# EAGLE design Bot (EAGLE 5.11)
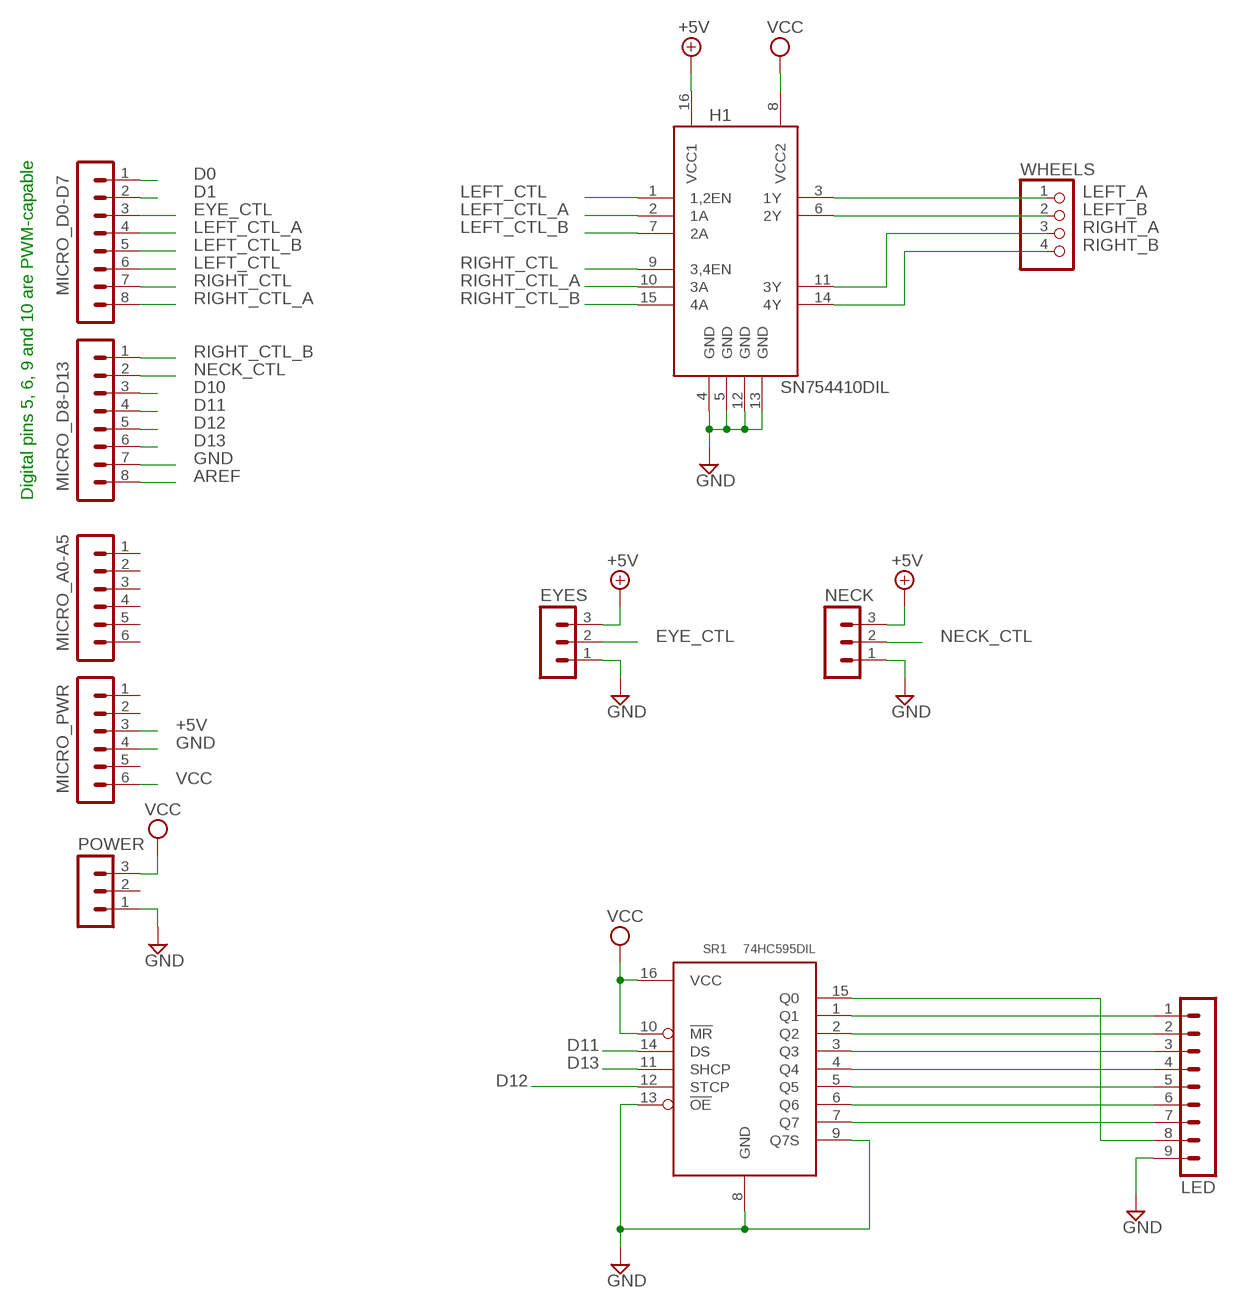
[diagram p0: schematic, sheet 1]

## Parts
EYES  MA03-1  [MA03-1]
H1  SN754410DIL  [DIL16]
LED  MA09-1  [MA09-1]
MICRO_A0-A5  MA06-1  [MA06-1]
MICRO_D0-D7  MA08-1  [MA08-1]
MICRO_D8-D13  MA08-1  [MA08-1]
MICRO_PWR  MA06-1  [MA06-1]
NECK  MA03-1  [MA03-1]
POWER  MA03-1  [MA03-1]
SR1  74HC595DIL  [DIL16]
WHEELS  PINHD-1X4  [1X04]

## Nets
+5V: EYES.3 H1.16(VCC1) MICRO_PWR.3 NECK.3
AREF: MICRO_D8-D13.8
D0: MICRO_D0-D7.1
D1: MICRO_D0-D7.2
D10: MICRO_D8-D13.3
D11: MICRO_D8-D13.4 SR1.14(DS)
D12: MICRO_D8-D13.5 SR1.12(STCP)
D13: MICRO_D8-D13.6 SR1.11(SHCP)
EYE_CTL: EYES.2 MICRO_D0-D7.3
GND: EYES.1 H1.4(GND) H1.5(GND) H1.12(GND) H1.13(GND) LED.9 MICRO_D8-D13.7 MICRO_PWR.4 NECK.1 POWER.1 SR1.8(GND) SR1.9(Q7S) SR1.13(!OE)
LEFT_A: H1.3(1Y) WHEELS.1
LEFT_B: H1.6(2Y) WHEELS.2
LEFT_CTL: H1.1(1,2EN) MICRO_D0-D7.6
LEFT_CTL_A: H1.2(1A) MICRO_D0-D7.4
LEFT_CTL_B: H1.7(2A) MICRO_D0-D7.5
N$2: LED.8 SR1.15(Q0)
N$3: SR1.1(Q1)
N$4: SR1.3(Q3)
N$5: SR1.4(Q4)
N$6: SR1.5(Q5)
N$7: SR1.6(Q6)
N$8: SR1.7(Q7)
N$9: SR1.2(Q2)
NECK_CTL: MICRO_D8-D13.2 NECK.2
RIGHT_A: H1.11(3Y) WHEELS.3
RIGHT_B: H1.14(4Y) WHEELS.4
RIGHT_CTL: H1.9(3,4EN) MICRO_D0-D7.7
RIGHT_CTL_A: H1.10(3A) MICRO_D0-D7.8
RIGHT_CTL_B: H1.15(4A) MICRO_D8-D13.1
VCC: H1.8(VCC2) MICRO_PWR.6 POWER.3 SR1.10(!MR) SR1.16(VCC)
Unconnected: LED.1 LED.2 LED.3 LED.4 LED.5 LED.6 LED.7 MICRO_A0-A5.1 MICRO_A0-A5.2 MICRO_A0-A5.3 MICRO_A0-A5.4 MICRO_A0-A5.5 MICRO_A0-A5.6 MICRO_PWR.1 MICRO_PWR.2 MICRO_PWR.5 POWER.2

## Notes on the sheet
- Digital pins 5, 6, 9 and 10 are PWM-capable

## Library data of the parts
EYES NECK POWER = con-lstb:MA03-1: PIN HEADER; OC_FARNELL: unknown; OC_NEWARK: unknown
H1 = BotParts:SN754410: Quadruple Half-H Driver
LED = con-lstb:MA09-1: PIN HEADER; OC_FARNELL: unknown; OC_NEWARK: unknown
MICRO_A0-A5 MICRO_PWR = con-lstb:MA06-1: PIN HEADER; OC_FARNELL: unknown; OC_NEWARK: unknown
MICRO_D0-D7 MICRO_D8-D13 = con-lstb:MA08-1: PIN HEADER; OC_FARNELL: unknown; OC_NEWARK: unknown
SR1 = BotParts:74HC595: 8-bit serial-in, serial or parallel-out shift register with output latches; 3-state
WHEELS = pinhead:PINHD-1X4: PIN HEADER

## Board
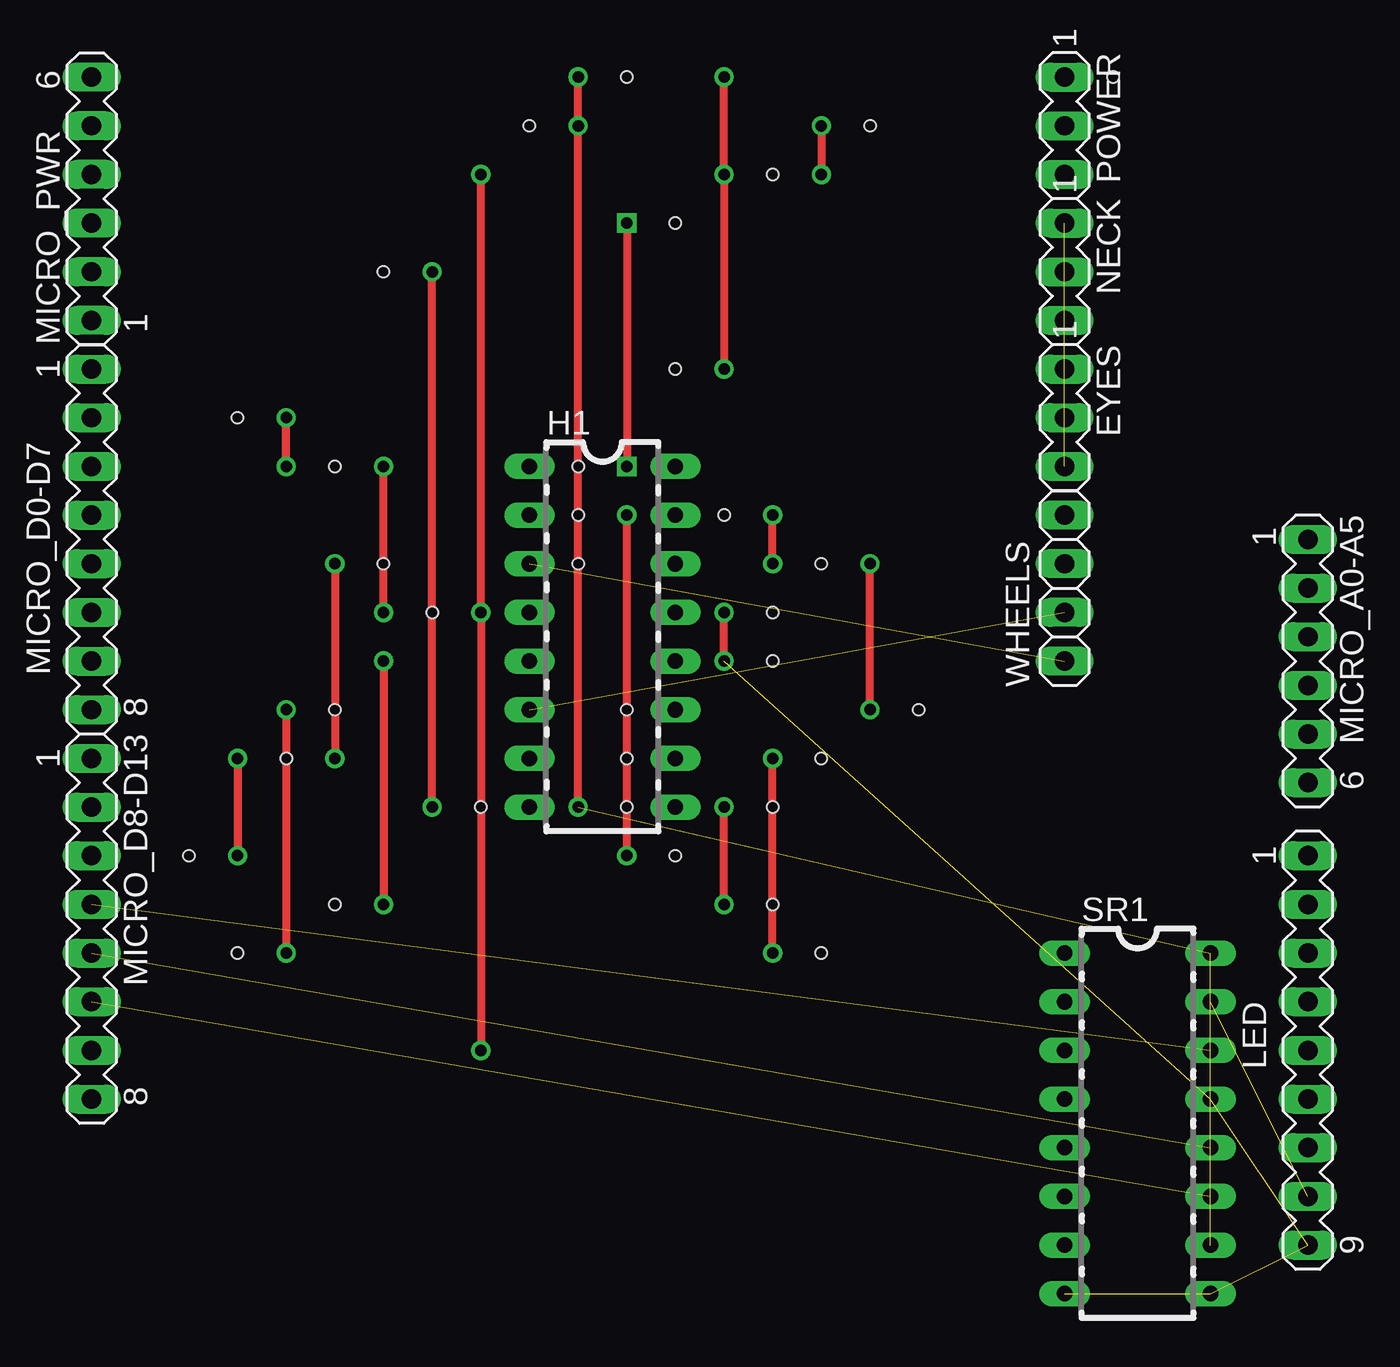
[diagram p1: board, top side]
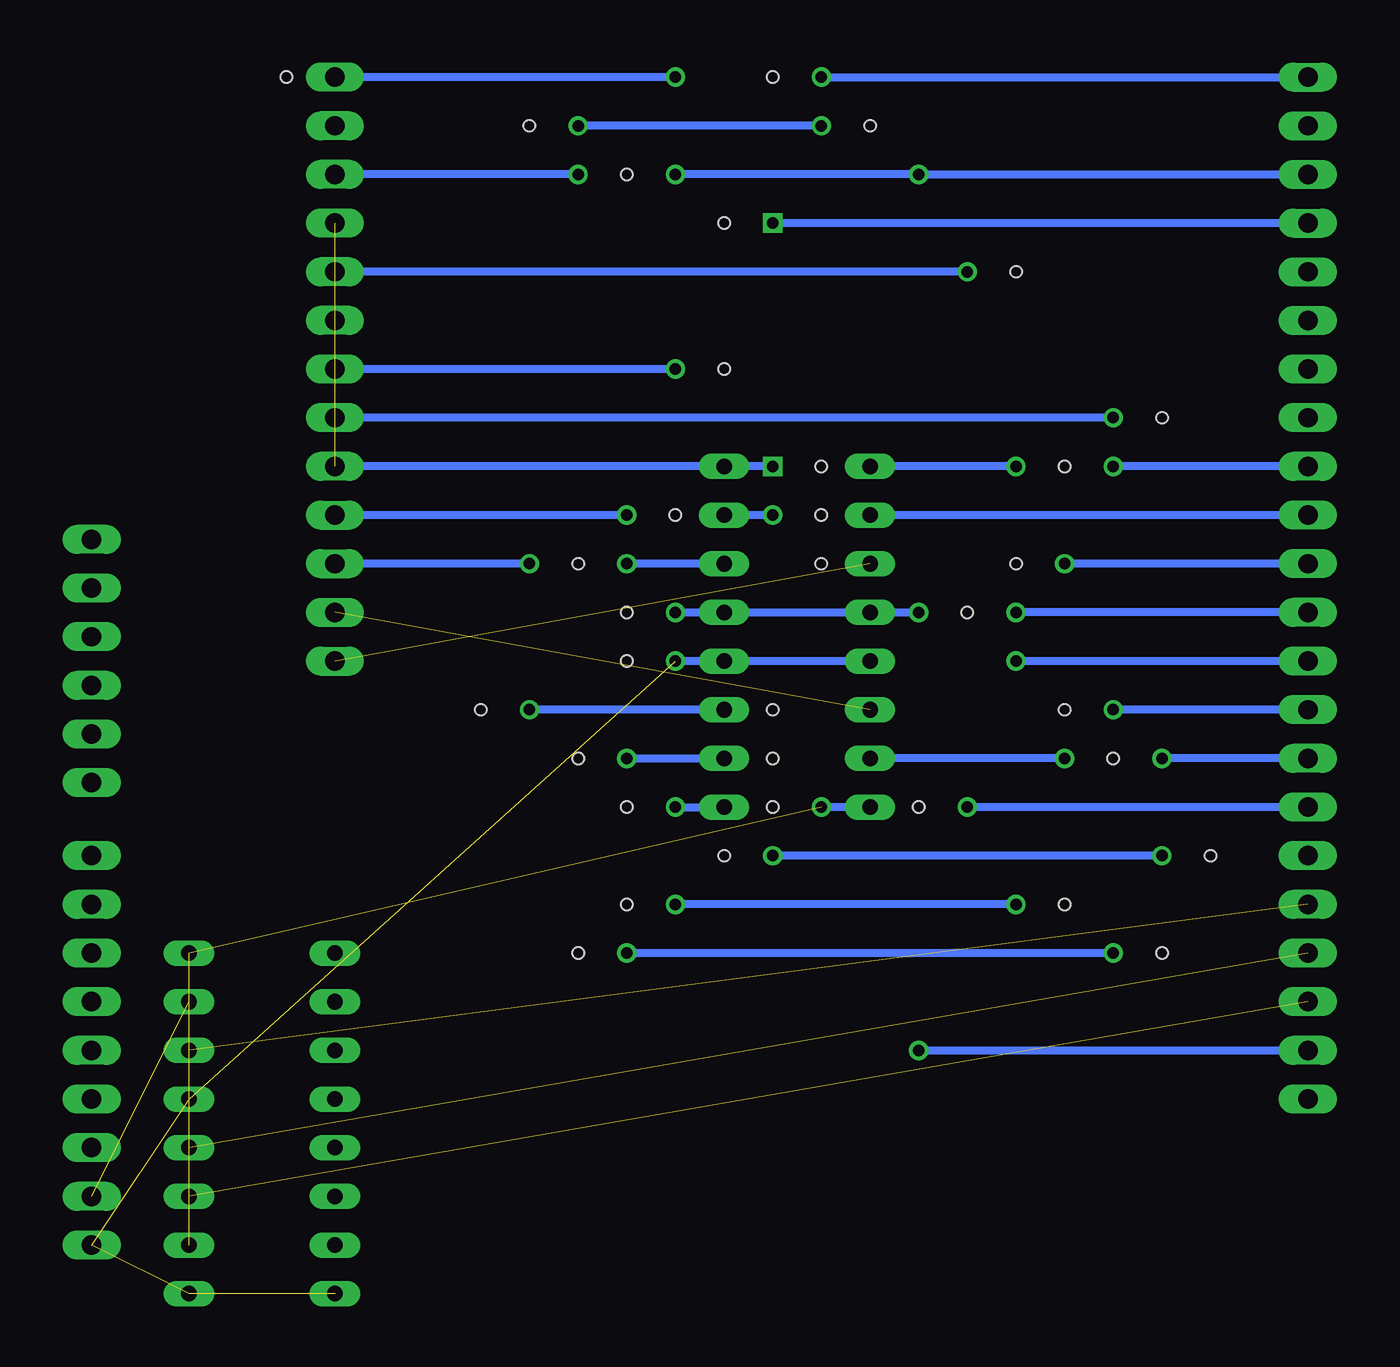
[diagram p2: board, bottom side, seen from below]

No outline drawn. Coordinates in mm, seen from the top.
Copper layers (1*16): Top 0.035mm / dielectric 1.5mm / Bottom 0.035mm
Design rules "default": minimum track width 10mil, minimum drill 24mil, track to track 8mil, track to pad 8mil, pad to pad 8mil, via to via 8mil, smd to smd 8mil, copper to edge 40mil, drill to drill 8mil, minimum pad ring 10mil, minimum via ring 8mil, stop-mask expansion 4mil, vias tented up to drill 0mil, thermal gap 10mil
Holes 0.6 mm at 66.04,68.58 33.02,30.48 43.18,60.96 40.64,68.58 38.1,48.26 38.1,45.72 38.1,43.18 40.64,35.56 40.64,33.02 40.64,30.48 48.26,63.5 30.48,40.64 25.4,48.26 20.32,50.8 43.18,53.34 53.34,66.04 35.56,66.04 48.26,40.64 48.26,38.1 22.86,33.02 27.94,43.18 17.78,27.94 43.18,27.94 48.26,30.48 48.26,25.4 25.4,25.4 45.72,45.72 50.8,43.18 55.88,35.56 50.8,33.02 50.8,22.86 20.32,22.86 25.4,35.56 27.94,58.42

### Footprints (pad centres in the part's own frame; a part is rotated, then mirrored left to right if it is on the bottom)
MA03-1 = drill 1.016 long: 1 -2.54,0; 2 0,0; 3 2.54,0
DIL16 = drill 0.813 long: 1 -8.89,-3.81; 2 -6.35,-3.81; 3 -3.81,-3.81; 4 -1.27,-3.81; 5 1.27,-3.81; 6 3.81,-3.81; 7 6.35,-3.81; 8 8.89,-3.81; 9 8.89,3.81; 10 6.35,3.81; 11 3.81,3.81; 12 1.27,3.81; 13 -1.27,3.81; 14 -3.81,3.81; 15 -6.35,3.81; 16 -8.89,3.81
MA09-1 = drill 1.016 long: 1 -10.16,0; 2 -7.62,0; 3 -5.08,0; 4 -2.54,0; 5 0,0; 6 2.54,0; 7 5.08,0; 8 7.62,0; 9 10.16,0
MA06-1 = drill 1.016 long: 1 -6.35,0; 2 -3.81,0; 3 -1.27,0; 4 1.27,0; 5 3.81,0; 6 6.35,0
MA08-1 = drill 1.016 long: 1 -8.89,0; 2 -6.35,0; 3 -3.81,0; 4 -1.27,0; 5 1.27,0; 6 3.81,0; 7 6.35,0; 8 8.89,0
1X04 = drill 1.016 long: 1 -3.81,0; 2 -1.27,0; 3 1.27,0; 4 3.81,0

### Placement (x,y rotation side)
EYES  63.5,50.8 270 top
H1  39.37,39.37 270 top
LED  76.2,17.78 270 top
MICRO_A0-A5  76.2,38.1 270 top
MICRO_D0-D7  12.7,44.45 270 top
MICRO_D8-D13  12.7,24.13 270 top
MICRO_PWR  12.7,62.23 90 top
NECK  63.5,58.42 270 top
POWER  63.5,66.04 270 top
SR1  67.31,13.97 270 top
WHEELS  63.5,41.91 90 top

### Tracks (layer width: path | path; a pad name or v marks a point on that pad's centre or on a via)
+5V  (via drill 0.6)  (1 unrouted)
  Top 0.406: v40.64,60.96 v40.64,48.26
  Bottom 0.406: MICRO_PWR.3 v40.64,60.96 | v40.64,48.26 H1.16 EYES.3
D11  (1 unrouted)
D12  (1 unrouted)
D13  (1 unrouted)
EYE_CTL  (via drill 0.6)
  Top 0.406: v22.86,48.26 v22.86,50.8
  Bottom 0.406: MICRO_D0-D7.3 v22.86,48.26 | v22.86,50.8 EYES.2
GND  (via drill 0.6)  (5 unrouted)
  Top 0.406: v33.02,63.5 v33.02,40.64 v33.02,17.78 | v45.72,38.1 v45.72,40.64 | v45.72,53.34 v45.72,63.5 v45.72,68.58
  Bottom 0.406: H1.5 H1.12 v45.72,38.1 | v33.02,40.64 H1.4 H1.13 v45.72,40.64 | MICRO_PWR.4 v33.02,63.5 v45.72,63.5 | v45.72,53.34 EYES.1 | v45.72,68.58 POWER.1 | v33.02,17.78 MICRO_D8-D13.7
LEFT_A  (1 unrouted)
LEFT_B  (1 unrouted)
LEFT_CTL  (via drill 0.6)
  Top 0.406: v27.94,40.64 v27.94,48.26
  Bottom 0.406: v27.94,48.26 H1.1 | MICRO_D0-D7.6 v27.94,40.64
LEFT_CTL_A
  Bottom 0.406: MICRO_D0-D7.4 H1.2
LEFT_CTL_B  (via drill 0.6)
  Top 0.406: v25.4,43.18 v25.4,33.02
  Bottom 0.406: MICRO_D0-D7.5 v25.4,43.18 | v25.4,33.02 H1.7
N$2  (1 unrouted)
NECK_CTL  (via drill 0.6)
  Top 0.406: v30.48,30.48 v30.48,58.42
  Bottom 0.406: MICRO_D8-D13.2 v30.48,30.48 | v30.48,58.42 NECK.2
RIGHT_A  (via drill 0.6)
  Top 0.406: v53.34,35.56 v53.34,43.18
  Bottom 0.406: H1.11 v53.34,35.56 | v53.34,43.18 WHEELS.3
RIGHT_B  (via drill 0.6)
  Top 0.406: v48.26,43.18 v48.26,45.72
  Bottom 0.406: H1.14 v48.26,43.18 | v48.26,45.72 WHEELS.4
RIGHT_CTL  (via drill 0.6)
  Top 0.406: v27.94,38.1 v27.94,25.4 | v45.72,25.4 v45.72,30.48
  Bottom 0.406: MICRO_D0-D7.7 v27.94,38.1 | v27.94,25.4 v45.72,25.4 | v45.72,30.48 H1.9
RIGHT_CTL_A  (via drill 0.6)
  Top 0.406: v22.86,35.56 v22.86,22.86 | v48.26,22.86 v48.26,33.02
  Bottom 0.406: MICRO_D0-D7.8 v22.86,35.56 | v22.86,22.86 v48.26,22.86 | v48.26,33.02 H1.10
RIGHT_CTL_B  (via drill 0.6)
  Top 0.406: v40.64,27.94 v40.64,45.72 | v20.32,33.02 v20.32,27.94
  Bottom 0.406: v40.64,45.72 H1.15 | v20.32,27.94 v40.64,27.94 | MICRO_D8-D13.1 v20.32,33.02
VCC  (via drill 0.6)  (2 unrouted)
  Top 0.406: v38.1,30.48 v38.1,66.04 v38.1,68.58 | v50.8,66.04 v50.8,63.5
  Bottom 0.406: v38.1,68.58 MICRO_PWR.6 | H1.8 v38.1,30.48 | v50.8,63.5 POWER.3 | v38.1,66.04 v50.8,66.04